# EAGLE design backplane (EAGLE 7.7.0)
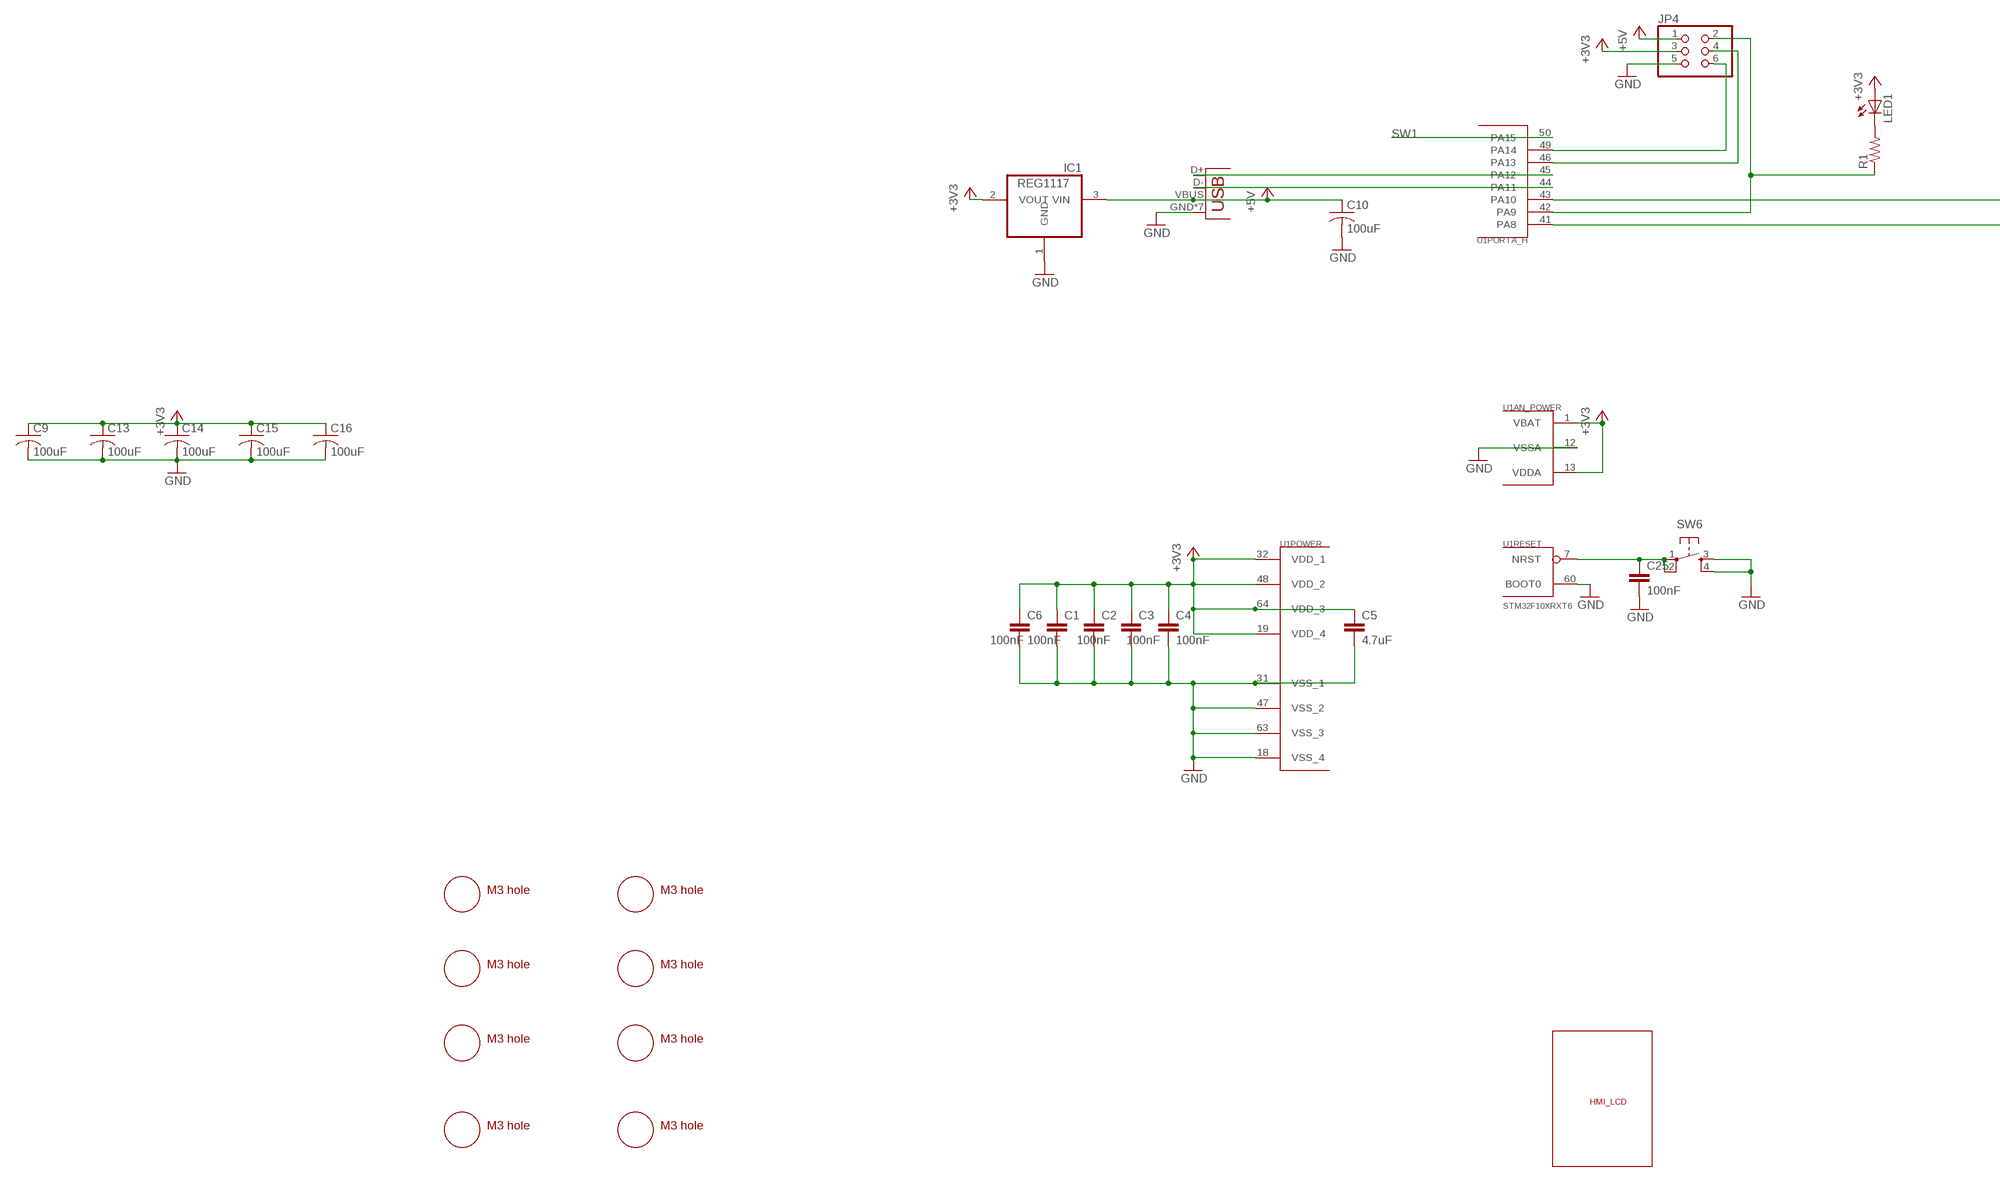
[diagram p0: schematic, sheet 1, part 1 of 2]
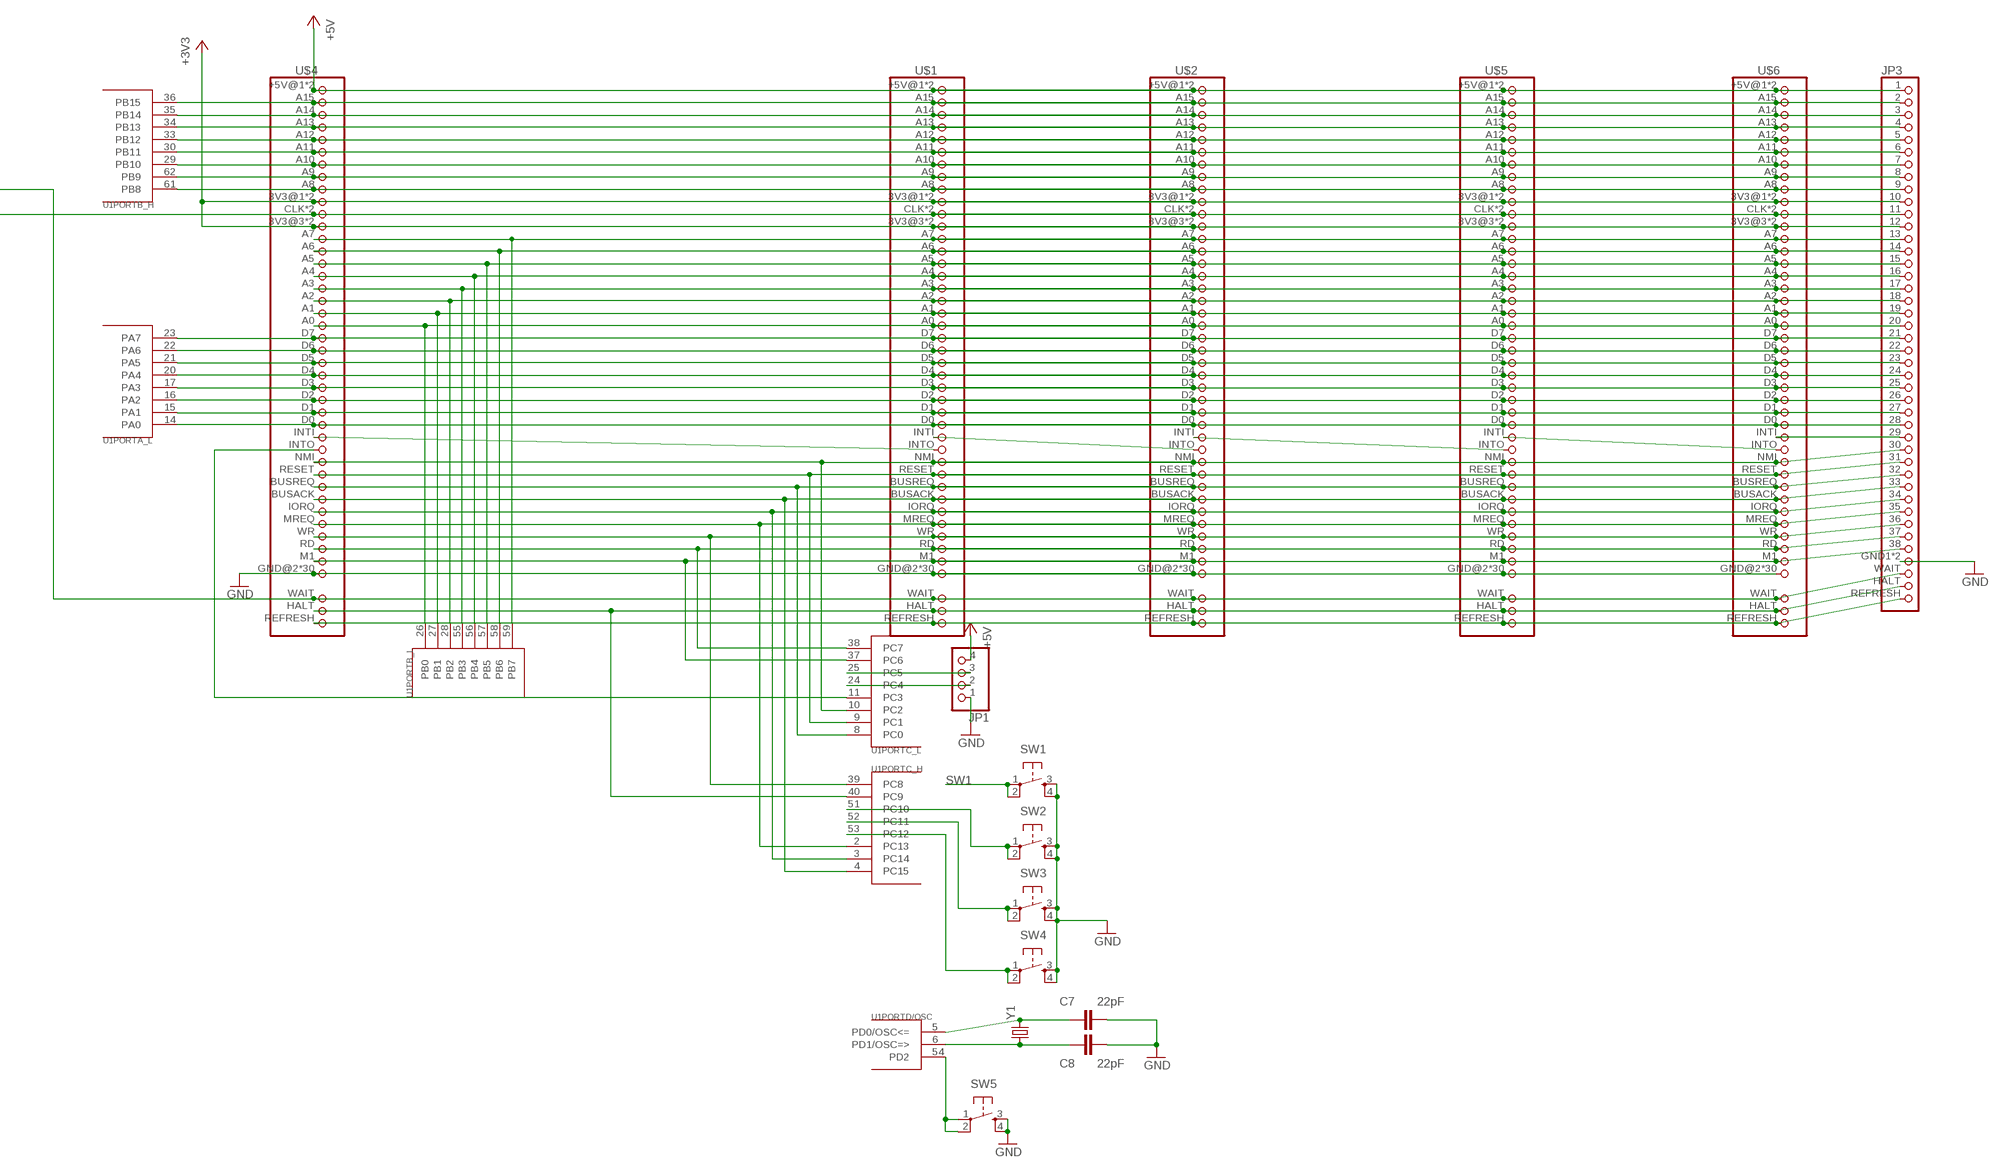
[diagram p1: schematic, sheet 1, part 2 of 2]

## Parts
C1  100nF  CAP0805  [0805]
C2  100nF  CAP0805  [0805]
C3  100nF  CAP0805  [0805]
C4  100nF  CAP0805  [0805]
C5  4.7uF  CAP0805  [0805]
C6  100nF  CAP0805  [0805]
C7  22pF  CAP0805  [0805]
C8  22pF  CAP0805  [0805]
C9  100uF  C-USC1210  [C1210]
C10  100uF  C-USC1210  [C1210]
C13  100uF  C-USC1210  [C1210]
C14  100uF  C-USC1210  [C1210]
C15  100uF  C-USC1210  [C1210]
C16  100uF  C-USC1210  [C1210]
C25  100nF  CAP0805  [0805]
IC1  REG1117  [SOT223]
J1  USB-MICROB  [USB-MICROB]
JP1  PINHD-1X4  [1X04]
JP3  PINHD-1X38  [1X38]
JP4  PINHD-2X3  [2X03]
LED1  LEDCHIP-LED0805  [CHIP-LED0805]
R1  R-US_R0805  [R0805]
SW1  SWITCH_SPST_4_PINSQUARE  [TACTILE-SWITCH-SMD]
SW2  SWITCH_SPST_4_PINSQUARE  [TACTILE-SWITCH-SMD]
SW3  SWITCH_SPST_4_PINSQUARE  [TACTILE-SWITCH-SMD]
SW4  SWITCH_SPST_4_PINSQUARE  [TACTILE-SWITCH-SMD]
SW5  SWITCH_SPST_4_PINSQUARE  [TACTILE-SWITCH-SMD]
SW6  SWITCH_SPST_4_PINSQUARE  [TACTILE-SWITCH-SMD]
U1  STM32F10XRXT6  [TQFP64]
U$1  FAP_BUS  [2X38]
U$2  FAP_BUS  [2X38]
U$3  HMI_LCD  [HMI_LCD]
U$4  FAP_BUS  [2X38]
U$5  FAP_BUS  [2X38]
U$6  FAP_BUS  [2X38]
U$7  M3_MOUNTING_HOLE  [M3_MOUNTING_HOLE_PACK]
U$8  M3_MOUNTING_HOLE  [M3_MOUNTING_HOLE_PACK]
U$9  M3_MOUNTING_HOLE  [M3_MOUNTING_HOLE_PACK]
U$10  M3_MOUNTING_HOLE  [M3_MOUNTING_HOLE_PACK]
U$11  M3_MOUNTING_HOLE  [M3_MOUNTING_HOLE_PACK]
U$12  M3_MOUNTING_HOLE  [M3_MOUNTING_HOLE_PACK]
U$13  M3_MOUNTING_HOLE  [M3_MOUNTING_HOLE_PACK]
U$14  M3_MOUNTING_HOLE  [M3_MOUNTING_HOLE_PACK]
Y1  CRYSTALHC49US  [HC49US]

## Nets
+3V3: C1.1 C2.1 C3.1 C4.1 C5.1 C6.1 C9.1 C13.1 C14.1 C15.1 C16.1 IC1.2(VOUT) JP3.10 JP3.12 JP4.3 LED1.A U1.1(AN_POWER:VBAT) U1.13(AN_POWER:VDDA) U1.19(POWER:VDD_4) U1.32(POWER:VDD_1) U1.48(POWER:VDD_2) U1.64(POWER:VDD_3) U$1.3V3@1 U$1.3V3@2 U$1.3V3@3 U$1.3V3@4 U$2.3V3@1 U$2.3V3@2 U$2.3V3@3 U$2.3V3@4 U$4.3V3@1 U$4.3V3@2 U$4.3V3@3 U$4.3V3@4 U$5.3V3@1 U$5.3V3@2 U$5.3V3@3 U$5.3V3@4 U$6.3V3@1 U$6.3V3@2 U$6.3V3@3 U$6.3V3@4
+5V: C10.1 IC1.3(VIN) J1.VBUS JP1.4 JP3.1 JP4.1 U$1.+5V@1 U$1.+5V@2 U$2.+5V@1 U$2.+5V@2 U$4.+5V@1 U$4.+5V@2 U$5.+5V@1 U$5.+5V@2 U$6.+5V@1 U$6.+5V@2
A0: JP3.20 U1.26(PORTB_L:PB0) U$1.A0 U$2.A0 U$4.A0 U$5.A0 U$6.A0
A7: JP3.13 U1.59(PORTB_L:PB7) U$1.A7 U$2.A7 U$4.A7 U$5.A7 U$6.A7
GND: C1.2 C2.2 C3.2 C4.2 C5.2 C6.2 C7.2 C8.2 C9.2 C10.2 C13.2 C14.2 C15.2 C16.2 C25.2 IC1.1(GND) J1.GND J1.P1(GND) J1.P2(GND) J1.P3(GND) J1.P4(GND) J1.P5(GND) J1.P6(GND) JP1.1 JP3.GND1(GND) JP3.GND2(GND) JP4.5 SW1.3 SW1.4 SW2.3 SW2.4 SW3.3 SW3.4 SW4.3 SW4.4 SW5.3 SW5.4 SW6.3 SW6.4 U1.12(AN_POWER:VSSA) U1.18(POWER:VSS_4) U1.31(POWER:VSS_1) U1.47(POWER:VSS_2) U1.60(RESET:BOOT0) U1.63(POWER:VSS_3) U$1.GND@2(GND) U$1.GND@3(GND) U$1.GND@4(GND) U$1.GND@5(GND) U$1.GND@6(GND) U$1.GND@7(GND) U$1.GND@8(GND) U$1.GND@9(GND) U$1.GND@13(GND) U$1.GND@14(GND) U$1.GND@15(GND) U$1.GND@16(GND) U$1.GND@17(GND) U$1.GND@18(GND) U$1.GND@19(GND) U$1.GND@20(GND) U$1.GND@21(GND) U$1.GND@22(GND) U$1.GND@23(GND) U$1.GND@24(GND) U$1.GND@25(GND) U$1.GND@26(GND) U$1.GND@27(GND) U$1.GND@28(GND) U$1.GND@30(GND) U$1.GND@34(GND) U$1.GND@35(GND) U$1.GND@36(GND) U$1.GND@37(GND) U$1.GND@38(GND) U$2.GND@2(GND) U$2.GND@3(GND) U$2.GND@4(GND) U$2.GND@5(GND) U$2.GND@6(GND) U$2.GND@7(GND) U$2.GND@8(GND) U$2.GND@9(GND) U$2.GND@13(GND) U$2.GND@14(GND) U$2.GND@15(GND) U$2.GND@16(GND) U$2.GND@17(GND) U$2.GND@18(GND) U$2.GND@19(GND) U$2.GND@20(GND) U$2.GND@21(GND) U$2.GND@22(GND) U$2.GND@23(GND) U$2.GND@24(GND) U$2.GND@25(GND) U$2.GND@26(GND) U$2.GND@27(GND) U$2.GND@28(GND) U$2.GND@30(GND) U$2.GND@34(GND) U$2.GND@35(GND) U$2.GND@36(GND) U$2.GND@37(GND) U$2.GND@38(GND) U$4.GND@2(GND) U$4.GND@3(GND) U$4.GND@4(GND) U$4.GND@5(GND) U$4.GND@6(GND) U$4.GND@7(GND) U$4.GND@8(GND) U$4.GND@9(GND) U$4.GND@13(GND) U$4.GND@14(GND) U$4.GND@15(GND) U$4.GND@16(GND) U$4.GND@17(GND) U$4.GND@18(GND) U$4.GND@19(GND) U$4.GND@20(GND) U$4.GND@21(GND) U$4.GND@22(GND) U$4.GND@23(GND) U$4.GND@24(GND) U$4.GND@25(GND) U$4.GND@26(GND) U$4.GND@27(GND) U$4.GND@28(GND) U$4.GND@30(GND) U$4.GND@34(GND) U$4.GND@35(GND) U$4.GND@36(GND) U$4.GND@37(GND) U$4.GND@38(GND) U$5.GND@2(GND) U$5.GND@3(GND) U$5.GND@4(GND) U$5.GND@5(GND) U$5.GND@6(GND) U$5.GND@7(GND) U$5.GND@8(GND) U$5.GND@9(GND) U$5.GND@13(GND) U$5.GND@14(GND) U$5.GND@15(GND) U$5.GND@16(GND) U$5.GND@17(GND) U$5.GND@18(GND) U$5.GND@19(GND) U$5.GND@20(GND) U$5.GND@21(GND) U$5.GND@22(GND) U$5.GND@23(GND) U$5.GND@24(GND) U$5.GND@25(GND) U$5.GND@26(GND) U$5.GND@27(GND) U$5.GND@28(GND) U$5.GND@30(GND) U$5.GND@34(GND) U$5.GND@35(GND) U$5.GND@36(GND) U$5.GND@37(GND) U$5.GND@38(GND) U$6.GND@2(GND) U$6.GND@3(GND) U$6.GND@4(GND) U$6.GND@5(GND) U$6.GND@6(GND) U$6.GND@7(GND) U$6.GND@8(GND) U$6.GND@9(GND) U$6.GND@13(GND) U$6.GND@14(GND) U$6.GND@15(GND) U$6.GND@16(GND) U$6.GND@17(GND) U$6.GND@18(GND) U$6.GND@19(GND) U$6.GND@20(GND) U$6.GND@21(GND) U$6.GND@22(GND) U$6.GND@23(GND) U$6.GND@24(GND) U$6.GND@25(GND) U$6.GND@26(GND) U$6.GND@27(GND) U$6.GND@28(GND) U$6.GND@30(GND) U$6.GND@34(GND) U$6.GND@35(GND) U$6.GND@36(GND) U$6.GND@37(GND) U$6.GND@38(GND)
N$1: JP3.29 U$6.INTI
N$2: U$5.INTI U$6.INTO
N$3: JP3.3 U1.35(PORTB_H:PB14) U$1.A14 U$2.A14 U$4.A14 U$5.A14 U$6.A14
N$4: JP3.4 U1.34(PORTB_H:PB13) U$1.A13 U$2.A13 U$4.A13 U$5.A13 U$6.A13
N$5: U$1.INTO U$4.INTI
N$6: U$1.INTI U$2.INTO
N$7: JP3.7 U1.29(PORTB_H:PB10) U$1.A10 U$2.A10 U$4.A10 U$5.A10 U$6.A10
N$8: U1.11(PORTC_L:PC3) U$4.INTO
N$9: JP3.9 U1.61(PORTB_H:PB8) U$1.A8 U$2.A8 U$4.A8 U$5.A8 U$6.A8
N$10: U$2.INTI U$5.INTO
N$11: JP3.22 U1.22(PORTA_L:PA6) U$1.D6 U$2.D6 U$4.D6 U$5.D6 U$6.D6
N$12: LED1.C R1.2
N$13: JP3.24 U1.20(PORTA_L:PA4) U$1.D4 U$2.D4 U$4.D4 U$5.D4 U$6.D4
N$14: JP3.27 U1.15(PORTA_L:PA1) U$1.D1 U$2.D1 U$4.D1 U$5.D1 U$6.D1
N$16: JP3.26 U1.16(PORTA_L:PA2) U$1.D2 U$2.D2 U$4.D2 U$5.D2 U$6.D2
N$18: JP3.28 U1.14(PORTA_L:PA0) U$1.D0 U$2.D0 U$4.D0 U$5.D0 U$6.D0
N$19: JP3.REFRESH U$1.REFRESH U$2.REFRESH U$4.REFRESH U$5.REFRESH U$6.REFRESH
N$20: JP3.30 U1.10(PORTC_L:PC2) U$1.NMI U$2.NMI U$4.NMI U$5.NMI U$6.NMI
N$21: JP3.HALT U1.40(PORTC_H:PC9) U$1.HALT U$2.HALT U$4.HALT U$5.HALT U$6.HALT
N$22: JP3.25 U1.17(PORTA_L:PA3) U$1.D3 U$2.D3 U$4.D3 U$5.D3 U$6.D3
N$23: JP3.31 U1.9(PORTC_L:PC1) U$1.RESET U$2.RESET U$4.RESET U$5.RESET U$6.RESET
N$24: JP3.32 U1.8(PORTC_L:PC0) U$1.BUSREQ U$2.BUSREQ U$4.BUSREQ U$5.BUSREQ U$6.BUSREQ
N$25: JP3.35 U1.2(PORTC_H:PC13) U$1.MREQ U$2.MREQ U$4.MREQ U$5.MREQ U$6.MREQ
N$26: JP3.36 U1.39(PORTC_H:PC8) U$1.WR U$2.WR U$4.WR U$5.WR U$6.WR
N$27: JP3.WAIT U1.43(PORTA_H:PA10) U$1.WAIT U$2.WAIT U$4.WAIT U$5.WAIT U$6.WAIT
N$28: JP3.38 U1.37(PORTC_L:PC6) U$1.M1 U$2.M1 U$4.M1 U$5.M1 U$6.M1
N$30: JP3.23 U1.21(PORTA_L:PA5) U$1.D5 U$2.D5 U$4.D5 U$5.D5 U$6.D5
N$31: JP3.15 U1.57(PORTB_L:PB5) U$1.A5 U$2.A5 U$4.A5 U$5.A5 U$6.A5
N$34: JP3.8 U1.62(PORTB_H:PB9) U$1.A9 U$2.A9 U$4.A9 U$5.A9 U$6.A9
N$38: JP3.21 U1.23(PORTA_L:PA7) U$1.D7 U$2.D7 U$4.D7 U$5.D7 U$6.D7
N$39: JP3.6 U1.30(PORTB_H:PB11) U$1.A11 U$2.A11 U$4.A11 U$5.A11 U$6.A11
N$40: JP3.5 U1.33(PORTB_H:PB12) U$1.A12 U$2.A12 U$4.A12 U$5.A12 U$6.A12
N$43: JP3.2 U1.36(PORTB_H:PB15) U$1.A15 U$2.A15 U$4.A15 U$5.A15 U$6.A15
N$45: JP3.19 U1.27(PORTB_L:PB1) U$1.A1 U$2.A1 U$4.A1 U$5.A1 U$6.A1
N$47: JP3.17 U1.55(PORTB_L:PB3) U$1.A3 U$2.A3 U$4.A3 U$5.A3 U$6.A3
N$48: JP3.16 U1.56(PORTB_L:PB4) U$1.A4 U$2.A4 U$4.A4 U$5.A4 U$6.A4
N$52: JP3.11 U1.41(PORTA_H:PA8) U$1.CLK U$1.CLK@2 U$2.CLK U$2.CLK@2 U$4.CLK U$4.CLK@2 U$5.CLK U$5.CLK@2 U$6.CLK U$6.CLK@2
N$54: JP1.2 U1.24(PORTC_L:PC4)
N$55: JP1.3 U1.25(PORTC_L:PC5)
N$56: JP3.33 U1.4(PORTC_H:PC15) U$1.BUSACK U$2.BUSACK U$4.BUSACK U$5.BUSACK U$6.BUSACK
N$57: JP3.34 U1.3(PORTC_H:PC14) U$1.IORQ U$2.IORQ U$4.IORQ U$5.IORQ U$6.IORQ
N$58: C25.1 SW6.1 SW6.2 U1.7(RESET:NRST)
N$59: SW5.1 SW5.2 U1.54(PORTD/OSC:PD2)
N$62: JP4.6 U1.49(PORTA_H:PA14)
N$63: SW2.1 SW2.2 U1.51(PORTC_H:PC10)
N$64: SW3.1 SW3.2 U1.52(PORTC_H:PC11)
N$65: SW4.1 SW4.2 U1.53(PORTC_H:PC12)
N$66: JP4.4 U1.46(PORTA_H:PA13)
N$67: JP4.2 R1.1 U1.42(PORTA_H:PA9)
N$68: JP3.37 U1.38(PORTC_L:PC7) U$1.RD U$2.RD U$4.RD U$5.RD U$6.RD
N$93: J1.D+ U1.45(PORTA_H:PA12)
N$94: C8.1 U1.6(PORTD/OSC:PD1/OSC=>) Y1.1
N$95: C7.1 U1.5(PORTD/OSC:PD0/OSC<=) Y1.2
N$96: J1.D- U1.44(PORTA_H:PA11)
N$128: JP3.14 U1.58(PORTB_L:PB6) U$1.A6 U$2.A6 U$4.A6 U$5.A6 U$6.A6
N$132: JP3.18 U1.28(PORTB_L:PB2) U$1.A2 U$2.A2 U$4.A2 U$5.A2 U$6.A2
SW1: SW1.1 SW1.2 U1.50(PORTA_H:PA15)

## Library data of the parts
C1-C8 C25 = SparkFun-Capacitors:CAP: Capacitor Standard 0603 ceramic capacitor, and 0.1" leaded capacitor.
C9 C10 C13-C16 = adafruit:C-US: CAPACITOR, American symbol
IC1 = burr-brown:REG1117: 800mA and 1A Low Dropout (LDO) Positive Regulator 1.8V, 2.5V, 2.85V, 3.3V, 5V, and Adj; MPN: REG1117; OC_FARNELL: 1097566; OC_NEWARK: 14P6981
J1 = v3:USB: USB Connectors USB-B-PTH is fully proven SKU : PRT-00139/CONN-08278 USB-miniB is fully proven SKU : PRT-00587 USB-A-PCB is untested. USB-A-H is throughly reviewed, but untested. Spark Fun Electronics SKU : PRT-00437 USB-B-SMT is throughly reviewed, but untested. Needs silkscreen touching up. USB-A-S has not been used/tested USB-MB-H has not been used/tested USB-MICROB has been used. CONN-09505; PROD_ID: CONN-09505
JP1 = pinhead:PINHD-1X4: PIN HEADER
JP3 = fap_bus_backplane:PINHD-1X38: PIN HEADER
JP4 = pinhead:PINHD-2X3: PIN HEADER
LED1 = adafruit:LED: LED OSRAM: - CHIPLED LG R971, LG N971, LY N971, LG Q971, LY Q971, LO R971, LY R971 LH N974, LH R974 LS Q976, LO Q976, LY Q976 LO Q996 - Hyper CHIPLED LW Q18S LB Q993, LB Q99A, LB R99A - SideLED LS A670, LO A670, LY A670, LG A670, LP A670 LB A673, LV A673, LT A673, LW A673 LH A674 LY A675 LS A676, LA A676, LO A676, LY A676, LW A676 LS A679, LY A679, LG A679 - Hyper Micro SIDELED® LS Y876, LA Y876, LO Y876, LY Y876 LT Y87S - SmartLED LW L88C, LW L88S LB L89C, LB L89S, LG L890 LS L89K, LO L89K, LY L89K LS L896, LA L896, LO L896, LY L896 - TOPLED LS T670, LO T670, LY T670, LG T670, LP T670 LSG T670, LSP T670, LSY T670, LOP T670, LYG T670 LG T671, LOG T671, LSG T671 LB T673, LV T673, LT T673, LW T673 LH T674 LS T676, LA T676, LO T676, LY T676, LB T676, LH T676, LSB T676, LW T676 LB T67C, LV T67C, LT T67C, LS T67K, LO T67K, LY T67K, LW E67C LS E67B, LA E67B, LO E67B, LY E67B, LB E67C, LV E67C, LT E67C LW T67C LS T679, LY T679, LG T679 LS T770, LO T770, LY T770, LG T770, LP T770 LB T773, LV T773, LT T773, LW T773 LH T774 LS E675, LA E675, LY E675, LS T675 LS T776, LA T776, LO T776, LY T776, LB T776 LHGB T686 LT T68C, LB T68C - Hyper Mini TOPLED® LB M676 - Mini TOPLED Santana® LG M470 LS M47K, LO M47K, LY M47K Source: http://www.osram.convergy.de/
R1 = adafruit:R-US_: RESISTOR, American symbol
SW1-SW6 = SparkFun-Electromechanical:SWITCH_SPST_4_PIN; PROD_ID: SWCH-08247
U1 = stm32:STM32F10XRXT6: STM32F101/103 64pin LQFP
U$1 U$2 U$4-U$6 = fap_bus_backplane:FAP_BUS
U$3 = hmi_lcd:HMI_LCD
U$7-U$14 = m3_mounting_hole:M3_MOUNTING_HOLE
Y1 = SparkFun-FreqCtrl:CRYSTAL: Various standard crystals. Proven footprints.

## Board
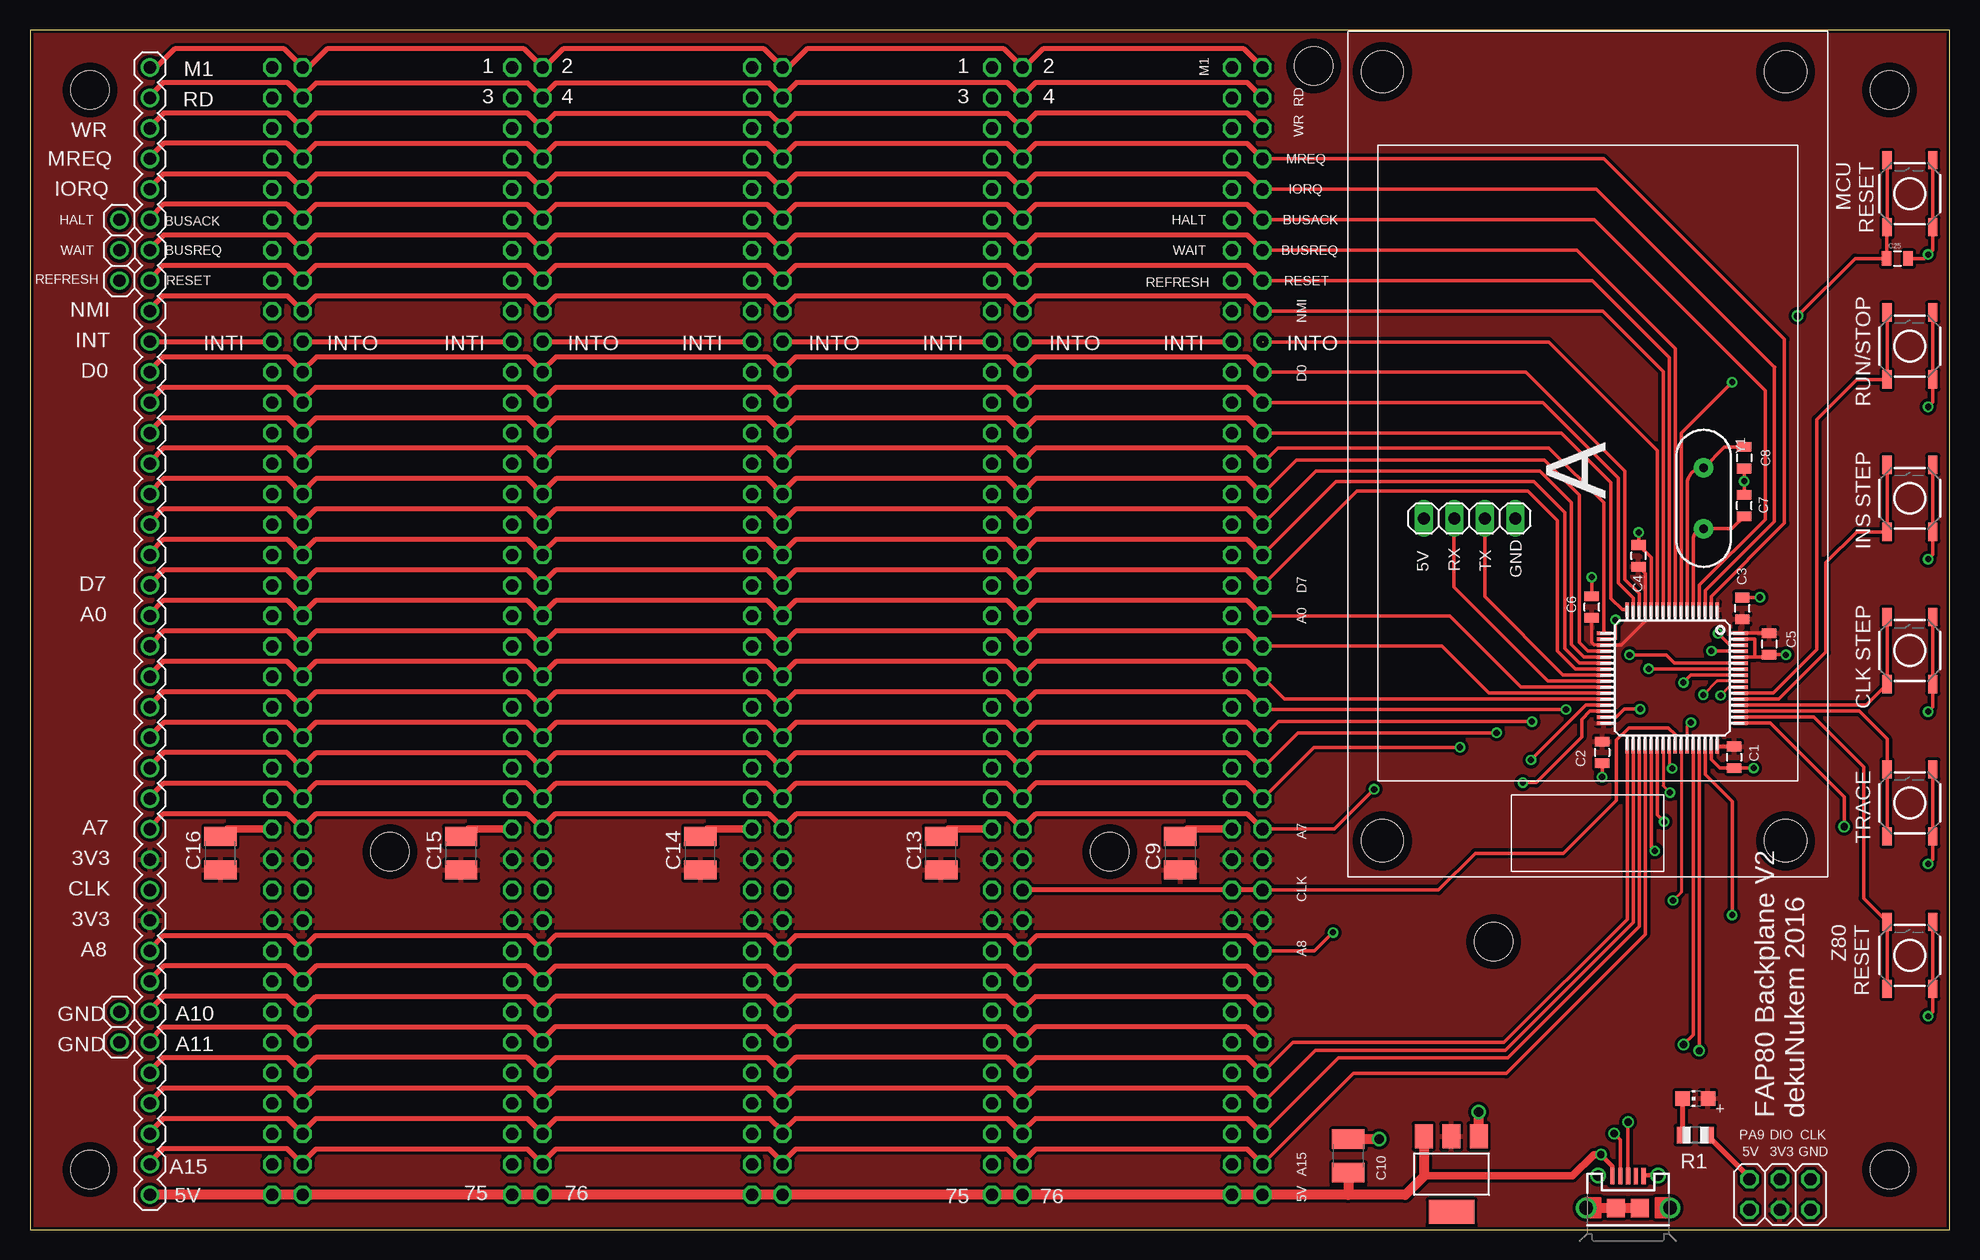
[diagram p2: board, top side]
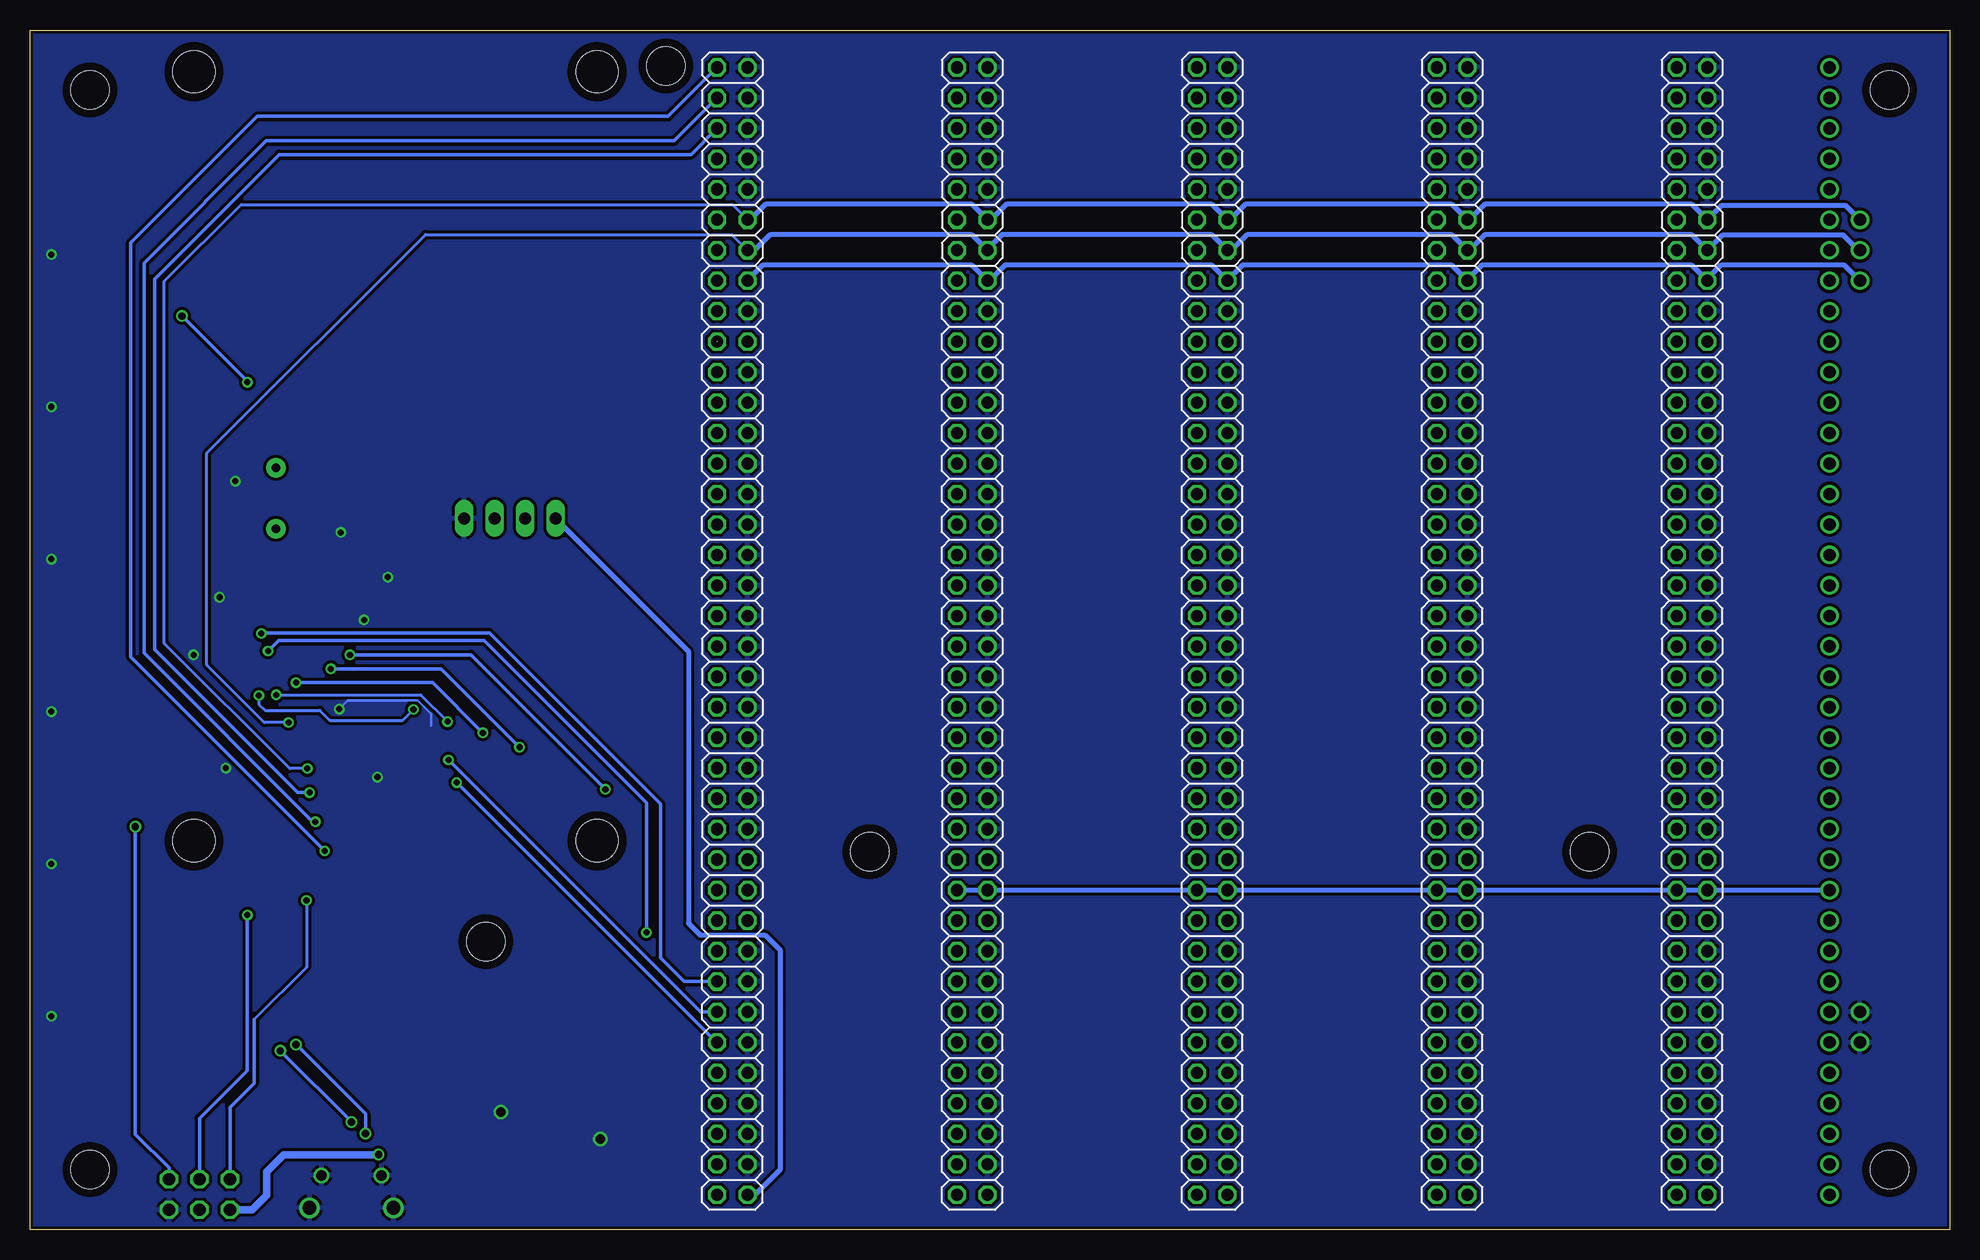
[diagram p3: board, bottom side, seen from below]

Size 160 x 100 mm. Coordinates in mm from the lower left corner, seen from the top.
Outline: 0,0 160,0 160,100 0,100 0,0
Copper layers (1*16): Top 0.035mm / dielectric 1.5mm / Bottom 0.035mm
Design rules "SparkFun-2-layer-TIGHT": minimum track width 7mil, minimum drill 15mil, track to track 7mil, track to pad 7mil, pad to pad 7mil, via to via 7mil, smd to smd 7mil, copper to edge 7mil, drill to drill 7mil, minimum pad ring 7mil, minimum via ring 7mil, stop-mask expansion 4mil, vias tented up to drill 25mil, thermal gap 10mil

### Footprints (pad centres in the part's own frame; a part is rotated, then mirrored left to right if it is on the bottom)
0805 = smd 0.8 x 1.2: 1 -0.9,0; 2 0.9,0
C1210 = smd 1.6 x 2.7: 1 -1.4,0; 2 1.4,0
SOT223 = smd 1.499 x 2.007: 1 -2.261,-3.15; 2 0.025,-3.15; 3 2.311,-3.15 | smd 3.81 x 2.007: 4 0,3.15
USB-MICROB = smd 0.35 x 1.4: D+ 0,2.65; D- -0.65,2.65; GND 1.3,2.65; ID 0.65,2.65; VBUS -1.3,2.65 | smd 1.5 x 1.55: P1 -1,0; P2 1,0 | drill 1.15 pad 1.422: P3 -3.5,0; P4 3.5,0 | drill 0.85 pad 1.27: P5 -2.5,2.7; P6 2.5,2.7
1X04 = drill 1.016 long: 1 -3.81,0; 2 -1.27,0; 3 1.27,0; 4 3.81,0
1X38 = drill 1.016: 1 -49.53,0; 2 -46.99,0; 3 -44.45,0; 4 -41.91,0; 5 -39.37,0; 6 -36.83,0; 7 -34.29,0; 8 -31.75,0; 9 -29.21,0; 10 -26.67,0; 11 -24.13,0; 12 -21.59,0; 13 -19.05,0; 14 -16.51,0; 15 -13.97,0; 16 -11.43,0; 17 -8.89,0; 18 -6.35,0; 19 -3.81,0; 20 -1.27,0; 21 1.27,0; 22 3.81,0; 23 6.35,0; 24 8.89,0; 25 11.43,0; 26 13.97,0; 27 16.51,0; 28 19.05,0; 29 21.59,0; 30 24.13,0; 31 26.67,0; 32 29.21,0; 33 31.75,0; 34 34.29,0; 35 36.83,0; 36 39.37,0; 37 41.91,0; 38 44.45,0; GND1 -36.83,2.54; GND2 -34.29,2.54; HALT 31.75,2.54; REFRESH 26.67,2.54; WAIT 29.21,2.54
2X03 = drill 1.016 octagon: 1 -2.54,-1.27; 2 -2.54,1.27; 3 0,-1.27; 4 0,1.27; 5 2.54,-1.27; 6 2.54,1.27
CHIP-LED0805 = smd 1.2 x 1.2: A 0,-1.05; C 0,1.05
R0805 = smd 1.1 x 1.4: 1 -1,0; 2 1,0
TACTILE-SWITCH-SMD = smd 1.524 x 0.762: 1 -2.794,1.905; 2 2.794,1.905; 3 -2.794,-1.905; 4 2.794,-1.905
TQFP64 = smd 1.2 x 0.3: 1 -5.7,3.75; 2 -5.7,3.25; 3 -5.7,2.75; 4 -5.7,2.25; 5 -5.7,1.75; 6 -5.7,1.25; 7 -5.7,0.75; 8 -5.7,0.25; 9 -5.7,-0.25; 10 -5.7,-0.75; 11 -5.7,-1.25; 12 -5.7,-1.75; 13 -5.7,-2.25; 14 -5.7,-2.75; 15 -5.7,-3.25; 16 -5.7,-3.75; 33 5.7,-3.75; 34 5.7,-3.25; 35 5.7,-2.75; 36 5.7,-2.25; 37 5.7,-1.75; 38 5.7,-1.25; 39 5.7,-0.75; 40 5.7,-0.25; 41 5.7,0.25; 42 5.7,0.75; 43 5.7,1.25; 44 5.7,1.75; 45 5.7,2.25; 46 5.7,2.75; 47 5.7,3.25; 48 5.7,3.75 | smd 0.3 x 1.2: 17 -3.75,-5.7; 18 -3.25,-5.7; 19 -2.75,-5.7; 20 -2.25,-5.7; 21 -1.75,-5.7; 22 -1.25,-5.7; 23 -0.75,-5.7; 24 -0.25,-5.7; 25 0.25,-5.7; 26 0.75,-5.7; 27 1.25,-5.7; 28 1.75,-5.7; 29 2.25,-5.7; 30 2.75,-5.7; 31 3.25,-5.7; 32 3.75,-5.7; 49 3.75,5.7; 50 3.25,5.7; 51 2.75,5.7; 52 2.25,5.7; 53 1.75,5.7; 54 1.25,5.7; 55 0.75,5.7; 56 0.25,5.7; 57 -0.25,5.7; 58 -0.75,5.7; 59 -1.25,5.7; 60 -1.75,5.7; 61 -2.25,5.7; 62 -2.75,5.7; 63 -3.25,5.7; 64 -3.75,5.7
2X38 = drill 1.016 octagon: 3V3@1 -16.51,1.27; 3V3@2 -16.51,3.81; 3V3@3 -11.43,1.27; 3V3@4 -11.43,3.81; +5V@1 -39.37,1.27; +5V@2 -39.37,3.81; A0 8.89,1.27; A1 6.35,1.27; A2 3.81,1.27; A3 1.27,1.27; A4 -1.27,1.27; A5 -3.81,1.27; A6 -6.35,1.27; A7 -8.89,1.27; A8 -19.05,1.27; A9 -21.59,1.27; A10 -24.13,1.27; A11 -26.67,1.27; A12 -29.21,1.27; A13 -31.75,1.27; A14 -34.29,1.27; A15 -36.83,1.27; BUSACK 41.91,1.27; BUSREQ 39.37,1.27; CLK -13.97,1.27; CLK@2 -13.97,3.81; D0 29.21,1.27; D1 26.67,1.27; D2 24.13,1.27; D3 21.59,1.27; D4 19.05,1.27; D5 16.51,1.27; D6 13.97,1.27; D7 11.43,1.27; GND@2 -36.83,3.81; GND@3 -34.29,3.81; GND@4 -31.75,3.81; GND@5 -29.21,3.81; GND@6 -26.67,3.81; GND@7 -24.13,3.81; GND@8 -21.59,3.81; GND@9 -19.05,3.81; GND@13 -8.89,3.81; GND@14 -6.35,3.81; GND@15 -3.81,3.81; GND@16 -1.27,3.81; GND@17 1.27,3.81; GND@18 3.81,3.81; GND@19 6.35,3.81; GND@20 8.89,3.81; GND@21 11.43,3.81; GND@22 13.97,3.81; GND@23 16.51,3.81; GND@24 19.05,3.81; GND@25 21.59,3.81; GND@26 24.13,3.81; GND@27 26.67,3.81; GND@28 29.21,3.81; GND@30 34.29,3.81; GND@34 44.45,3.81; GND@35 46.99,3.81; GND@36 49.53,3.81; GND@37 52.07,3.81; GND@38 54.61,3.81; HALT 41.91,3.81; INTI 31.75,3.81; INTO 31.75,1.27; IORQ 44.45,1.27; M1 54.61,1.27; MREQ 46.99,1.27; NMI 34.29,1.27; RD 52.07,1.27; REFRESH 36.83,3.81; RESET 36.83,1.27; WAIT 39.37,3.81; WR 49.53,1.27
HMI_LCD = hole 3.5: 0,0; 64.1,0; 0,33.6; 64.1,33.6
M3_MOUNTING_HOLE_PACK = hole 3.2: 0,0
HC49US = drill 0.7 pad 1.651: 1 -2.54,0; 2 2.54,0

### Placement (x,y rotation side)
C1  142.04,39.37 270 top
C2  131.04,39.78 270 top
C3  142.73,51.79 90 top
C4  134.08,56.16 90 top
C5  144.96,48.82 270 top
C6  130.18,51.89 90 top
C7  142.88,60.35 90 top
C8  142.88,64.34 270 top
C9  95.89,31.37 90 top
C10  109.89,6.15 90 top
C13  75.95,31.37 90 top
C14  55.88,31.37 90 top
C15  35.94,31.37 90 top
C16  15.88,31.37 90 top
C25  155.66,80.95 0 top
IC1  118.5,4.62 180 top
J1  133.2,1.8 0 top
JP1  120,59.28 180 top
JP3  10,52.43 90 top
JP4  145.87,2.92 0 top
LED1  138.81,10.92 90 top
R1  138.81,7.87 180 top
SW1  156.7,22.86 90 top
SW2  156.7,35.56 90 top
SW3  156.7,48.26 90 top
SW4  156.7,60.96 90 top
SW5  156.7,73.66 90 top
SW6  156.7,86.36 90 top
U1  136.89,45.97 270 top
U$1  84,42.27 90 top
U$2  64,42.27 90 top
U$3  146.33,32.41 90 top
U$4  104,42.27 90 top
U$5  44,42.27 90 top
U$6  24,42.27 90 top
U$7  5,95 0 top
U$8  155,95 0 top
U$9  5,5 0 top
U$10  155,5 0 top
U$11  30,31.5 0 top
U$12  90,31.5 0 top
U$13  107,97 0 top
U$14  122,24 0 top
Y1  139.5,60.96 270 top

### Tracks (layer width: path | path; a pad name or v marks a point on that pad's centre or on a via)
+3V3
  Top 0.254: U1.19 130.37,48.72 130.18,48.92 C6.1
  Top 0.305: C4.1 134.64,54.7 U1.13 134.64,50.71 132.64,48.72 U1.19 | U1.48 C1.1 | U1.64 C5.1
  pour Top (isolate 0.254): -0.09,0.13 160,0 160,100 -0.09,100.13
+5V  (via drill 0.6)
  Top 0.356: J1.VBUS 131.9,5.29 v130.94,6.25
  Top 0.61: v130.94,6.25 130.35,6.25 128.57,4.47 116.46,4.47 116.21,4.72
  Top 0.813: 116.21,4.48 114.63,2.9 109.89,2.9 | 109.89,2.9 U$4.+5V@1 U$4.+5V@2 U$1.+5V@1 U$1.+5V@2 U$2.+5V@1 U$2.+5V@2 U$5.+5V@1 | 43.1,2.9 U$5.+5V@1 | U$5.+5V@1 U$5.+5V@2 U$6.+5V@1 U$6.+5V@2 JP3.1 | C10.1 109.89,2.9 | 116.22,4.47 116.21,4.48 | 116.21,4.48 116.21,4.72 116.21,7.75 IC1.3
  Bottom 0.406: JP1.4 105.11,48.2 105.11,25.53 104.14,24.56 98.73,24.56 97.48,23.32 97.48,4.98 99.57,2.9 U$4.+5V@2
  Bottom 0.61: v130.94,6.25 138.84,6.25 140.26,4.83 140.26,2.87 141.48,1.65 JP4.1
A0
  Top 0.305: U1.26 124.27,45.22 118.36,51.13 102.75,51.13 U$4.A0
  Top 0.406: U$4.A0 101.46,52.43 83.8,52.43 82.73,51.36 U$1.A0 81.46,52.43 63.8,52.43 62.73,51.35 U$2.A0 61.46,52.43 43.81,52.43 42.73,51.34 U$5.A0 41.46,52.43 23.8,52.43 22.73,51.36 U$6.A0 21.46,52.43 11.07,52.43 10,51.35 JP3.20
A7  (via drill 0.51)
  Top 0.305: v133.33,47.9 136.38,47.9 137.06,47.22 U1.59 | v112.04,36.7 108.71,33.38 U$4.A7
  Top 0.406: U$4.A7 101.46,34.65 83.82,34.65 82.73,33.56 U$1.A7 81.46,34.65 63.86,34.65 62.73,33.52 | 62.73,33.52 U$2.A7 | 62.73,33.52 61.6,34.65 43.76,34.65 42.73,33.61 U$5.A7 41.46,34.65 23.8,34.65 22.73,33.58 U$6.A7 21.46,34.65 11.07,34.65 10,33.57 JP3.13
  Bottom 0.305: v133.33,47.9 123.24,47.9 v112.04,36.7
GND  (via drill 0.51, 0.8)
  Top 0.305: v130.18,54.38 C6.2 | v132.16,50.83 132.16,49.22 U1.18 | v134.22,43.38 132.9,43.38 132.24,42.72 U1.31 | C8.2 v142.88,62.38 C7.2 | v131.04,37.72 C2.2 | SW1.4 SW1.3 158.6,18.16 v158.22,17.78 | SW2.4 SW2.3 158.6,30.86 v158.22,30.48 | SW3.4 SW3.3 158.6,43.56 v158.22,43.18 | SW4.4 SW4.3 158.6,56.26 v158.22,55.88 | SW5.4 SW5.3 158.6,68.96 v158.22,68.58 | SW6.4 SW6.3 158.6,81.66 v158.22,81.28 157.89,80.95 C25.2 | 143.77,47.72 144.77,47.72 C5.2 146.35,47.92 v146.36,47.9 | 143.77,47.72 U1.60 | U1.63 143.77,49.22 143.77,47.72 | U1.47 140.14,39.17 140.83,38.47 C1.2 v143.67,38.47 | U1.12 135.14,56.01 C4.2 134.09,57.07 v134.09,58.12 | v144.2,52.7 144.19,52.69 C3.2
  Top 0.356: J1.P6 134.55,4.5 J1.GND
  Top 0.61: C16.2 16.48,33.38 U$6.GND@13 | C15.2 36.55,33.38 U$5.GND@13 | C14.2 56.49,33.38 U$2.GND@13 | C13.2 76.55,33.38 U$1.GND@13 | C9.2 96.49,33.38 U$4.GND@13
  Top 0.813: 120.83,7.7 IC1.1 | IC1.1 v120.76,9.78 | C10.2 v112.45,7.54 | 120.84,7.69 IC1.1 | J1.P3 J1.P1 J1.P2
  Bottom 0.203: v134.22,43.38 133.51,44.09 127.69,44.09 126.57,42.98 126.57,42.01
  pour Bottom (isolate 0.254): 0,0 160,0 160,100.33 0,100
N$1
  Top 0.406: JP3.29 U$6.INTI
N$2
  Top 0.406: U$6.INTO U$5.INTI
N$3
  Top 0.305: U1.35 134.14,25.27 123.17,14.3 109.06,14.3 U$4.A14
  Top 0.406: 62.73,8.17 63.8,9.25 81.46,9.25 U$1.A14 82.73,8.18 83.8,9.25 101.46,9.25 U$4.A14 | 62.73,8.17 U$2.A14 | 62.73,8.17 61.66,9.25 43.81,9.25 42.73,8.16 U$5.A14 41.46,9.25 23.82,9.25 22.73,8.15 U$6.A14 21.46,9.25 11.1,9.25 10,8.15 JP3.3
N$4
  Top 0.305: U1.34 133.64,25.6 122.98,14.95 107.16,14.95 U$4.A13
  Top 0.406: U$4.A13 101.46,11.79 83.84,11.79 82.73,10.67 U$1.A13 81.46,11.79 63.8,11.79 62.73,10.71 U$2.A13 61.46,11.79 43.84,11.79 42.73,10.68 U$5.A13 41.46,11.79 23.8,11.79 22.73,10.72 U$6.A13 21.46,11.79 11.1,11.79 10,10.69 JP3.4
N$5
  Top 0.406: U$1.INTO U$4.INTI
N$6
  Top 0.406: U$2.INTO U$1.INTI
N$7  (via drill 0.51)
  Top 0.305: U1.29 129.7,43.72 v125.12,39.14
  Top 0.406: U$4.A10 101.46,19.41 83.8,19.41 82.73,18.34 U$1.A10 81.41,19.46 63.8,19.46 62.73,18.38 U$2.A10 61.44,19.43 43.79,19.43 42.73,18.37 U$5.A10 41.48,19.38 23.77,19.38 22.73,18.34 U$6.A10 21.41,19.46 11.1,19.46 10,18.36 JP3.7
  Bottom 0.305: v125.12,39.14 104.11,18.14 U$4.A10
N$8  (1 unrouted)
  Top 0.305: U1.11 135.64,64.95 126.59,73.99 102.75,73.99
N$9  (via drill 0.51)
  Top 0.305: 102.75,23.24 U$4.A8 107.06,23.22 v108.61,24.77 | v140.16,48.23 140.17,48.22 U1.61
  Top 0.406: U$4.A8 101.48,24.46 83.87,24.46 82.73,23.32 U$1.A8 81.46,24.49 63.8,24.49 62.73,23.41 U$2.A8 61.44,24.51 43.79,24.51 42.73,23.45 U$5.A8 41.46,24.49 23.77,24.49 22.73,23.44 U$6.A8 21.48,24.46 11.05,24.46 10,23.41 JP3.9
  Bottom 0.305: v140.16,48.23 139.27,49.12 122.15,49.12 108.61,35.58 v108.61,24.77
N$10
  Top 0.406: U$5.INTO U$2.INTI
N$11
  Top 0.305: U1.22 129.13,47.22 127.92,48.44 127.92,59.79 125.35,62.36 108.85,62.36 U$4.D6
  Top 0.406: U$4.D6 101.46,57.51 83.82,57.51 82.73,56.42 U$1.D6 81.46,57.51 63.8,57.51 62.73,56.43 U$2.D6 61.44,57.53 43.84,57.53 42.73,56.42 U$5.D6 41.46,57.51 23.77,57.51 22.73,56.46 U$6.D6 21.46,57.51 11.07,57.51 10,56.43 JP3.22
N$12
  Top 0.406: R1.2 137.76,7.92 LED1.C
N$13
  Top 0.305: U1.20 129.86,48.22 129.16,48.92 129.16,61.21 126.24,64.14 105.55,64.14 U$4.D4
  Top 0.406: U$4.D4 101.46,62.59 83.82,62.59 82.73,61.5 U$1.D4 81.46,62.59 63.8,62.59 62.73,61.51 U$2.D4 61.46,62.59 43.84,62.59 42.73,61.48 U$5.D4 41.46,62.59 23.82,62.59 22.73,61.49 U$6.D4 21.46,62.59 11.1,62.59 10,61.49 JP3.24
N$14
  Top 0.305: U1.15 133.64,52.65 132.39,53.9 132.39,62.64 126.09,68.94 U$4.D1
  Top 0.406: U$4.D1 101.46,70.21 83.8,70.21 82.73,69.14 U$1.D1 81.48,70.18 63.8,70.18 62.73,69.11 | 62.73,69.11 U$2.D1 | 62.73,69.11 61.63,70.21 43.81,70.21 42.73,69.12 U$5.D1 41.46,70.21 23.8,70.21 22.73,69.14 U$6.D1 21.46,70.21 11.1,70.21 10,69.11 JP3.27
N$16
  Top 0.305: U1.16 132.71,51.67 131.78,52.6 131.78,62.26 127.64,66.4 U$4.D2
  Top 0.406: U$4.D2 101.46,67.67 83.82,67.67 82.73,66.58 U$1.D2 81.46,67.67 63.8,67.67 62.73,66.59 U$2.D2 61.46,67.67 43.81,67.67 42.73,66.58 U$5.D2 41.46,67.67 23.82,67.67 22.73,66.57 U$6.D2 21.46,67.67 11.1,67.67 10,66.57 JP3.26
N$18
  Top 0.305: U1.14 134.14,53.02 132.95,54.2 132.95,63.22 124.69,71.48 U$4.D0
  Top 0.406: U$4.D0 101.46,72.75 83.82,72.75 82.73,71.66 U$1.D0 81.46,72.75 63.83,72.75 62.73,71.64 U$2.D0 61.46,72.75 43.84,72.75 42.73,71.64 U$5.D0 41.46,72.75 23.88,72.75 22.73,71.6 U$6.D0 21.46,72.75 11.1,72.75 10,71.65 JP3.28
N$19
  Bottom 0.406: JP3.REFRESH 8.75,80.39 19.05,80.39 20.19,79.25 U$6.REFRESH 21.48,80.39 38.99,80.39 40.19,79.19 U$5.REFRESH 41.48,80.39 58.93,80.39 60.19,79.13 U$2.REFRESH 61.48,80.39 78.74,80.39 80.03,79.1 U$1.REFRESH 81.48,80.39 98.93,80.39 100.19,79.13 U$4.REFRESH
N$20
  Top 0.305: U$4.NMI 131.12,76.56 136.14,71.54 U1.10
  Top 0.406: U$4.NMI 101.46,77.83 83.8,77.83 82.73,76.76 U$1.NMI 81.46,77.83 63.8,77.83 62.73,76.75 U$2.NMI 61.46,77.83 43.81,77.83 42.73,76.74 U$5.NMI 41.46,77.83 23.82,77.83 22.73,76.73 U$6.NMI 21.46,77.83 11.07,77.83 10,76.75 JP3.30
N$21  (via drill 0.5)
  Top 0.254: U1.40 136.64,38.67 v136.88,38.43
  Bottom 0.254: v136.88,38.43 138.35,38.43 148.79,48.87 148.79,79.05 142.39,85.45 101.45,85.45 U$4.HALT
  Bottom 0.406: JP3.HALT 8.64,85.34 19.02,85.34 U$6.HALT 21.48,85.47 38.73,85.47 40.03,84.18 U$5.HALT 41.48,85.47 58.67,85.47 59.97,84.18 U$2.HALT 61.48,85.47 78.61,85.47 79.91,84.18 U$1.HALT 81.48,85.47 98.68,85.47 99.97,84.18 U$4.HALT
N$22
  Top 0.305: U1.17 131.19,60.58 126.62,65.15 104.03,65.15 U$4.D3
  Top 0.406: U$4.D3 101.46,65.13 83.82,65.13 82.73,64.04 U$1.D3 81.46,65.13 63.83,65.13 62.73,64.03 U$2.D3 61.46,65.13 43.81,65.13 42.73,64.04 U$5.D3 41.46,65.13 23.8,65.13 22.73,64.06 U$6.D3 21.46,65.13 11.1,65.13 10,64.03 JP3.25
N$23
  Top 0.305: U$4.RESET 130.23,79.1 136.64,72.69 U1.9
  Top 0.406: U$4.RESET 101.46,80.37 83.8,80.37 82.73,79.3 U$1.RESET 81.46,80.37 63.83,80.37 62.73,79.27 U$2.RESET 61.46,80.37 43.81,80.37 42.73,79.28 U$5.RESET 41.46,80.37 23.82,80.37 22.73,79.27 U$6.RESET 21.46,80.37 11.07,80.37 10,79.29 JP3.31
N$24
  Top 0.305: U$4.BUSREQ 128.94,81.64 137.14,73.44 U1.8
  Top 0.406: U$4.BUSREQ 101.46,82.91 83.84,82.91 82.73,81.79 U$1.BUSREQ 81.46,82.91 63.83,82.91 62.73,81.81 U$2.BUSREQ 61.46,82.91 43.81,82.91 42.73,81.82 U$5.BUSREQ 41.46,82.91 23.82,82.91 22.73,81.81 U$6.BUSREQ 21.46,82.91 11.12,82.91 10,81.78 JP3.32
N$25
  Top 0.305: U$4.MREQ 131.19,89.26 146.23,74.21 146.23,58.88 140.14,52.78 U1.2
  Top 0.406: U$4.MREQ 101.46,90.53 83.82,90.53 82.73,89.44 U$1.MREQ 81.46,90.53 63.83,90.53 62.73,89.42 U$2.MREQ 61.46,90.53 43.81,90.53 42.73,89.44 U$5.MREQ 41.46,90.53 23.8,90.53 22.73,89.46 U$6.MREQ 21.43,90.55 11.12,90.55 10,89.43 JP3.35
N$26  (via drill 0.51)
  Top 0.254: U1.39 136.14,36.99 v136.7,36.42
  Top 0.406: 62.73,91.97 63.8,93.04 81.48,93.04 U$1.WR 82.73,91.95 83.84,93.07 101.46,93.07 U$4.WR | 62.73,91.97 U$2.WR | JP3.36 10,91.94 11.12,93.07 21.46,93.07 U$6.WR 22.73,91.94 23.85,93.07 41.46,93.07 U$5.WR 42.73,92.01 43.76,93.04 61.66,93.04 62.73,91.97
  Bottom 0.305: v136.7,36.42 137.67,36.42 149.61,48.36 149.61,79.25 139.24,89.61 104.91,89.61 U$4.WR
N$27  (via drill 0.5)
  Top 0.254: U1.43 138.14,41.95 v138.46,42.27
  Bottom 0.254: v138.46,42.27 140.46,42.27 145.26,47.07 145.26,64.72 127.03,82.96 101.51,82.96 U$4.WAIT
  Bottom 0.406: U$4.WAIT 99.59,81.64 98.3,82.93 81.48,82.93 U$1.WAIT 80.19,81.73 78.99,82.93 61.48,82.93 U$2.WAIT 59.84,81.64 58.55,82.93 41.48,82.93 U$5.WAIT 40.03,81.64 38.73,82.93 21.48,82.93 U$6.WAIT 18.89,82.93 8.89,82.93 7.6,81.64 JP3.WAIT
N$28  (via drill 0.51)
  Top 0.305: U1.37 135.14,31.87 v135.44,31.57
  Top 0.406: U$4.M1 101.18,98.42 84.45,98.42 82.91,96.88 U$1.M1 81.18,98.42 64.77,98.42 63.22,96.88 U$2.M1 61.18,98.42 44.45,98.42 42.9,96.88 U$5.M1 41.18,98.42 24.77,98.42 23.22,96.88 U$6.M1 21.18,98.42 12.06,98.42 10.52,96.88 JP3.38
  Bottom 0.305: v135.44,31.57 151.59,47.71 151.59,82.27 141.05,92.81 106.79,92.81 U$4.M1
N$30
  Top 0.305: U1.21 129.52,47.72 128.48,48.77 128.48,60.62 125.86,63.25 107.2,63.25 U$4.D5
  Top 0.406: U$4.D5 101.46,60.05 83.77,60.05 82.73,59.01 U$1.D5 81.46,60.05 63.8,60.05 62.73,58.97 U$2.D5 61.46,60.05 43.81,60.05 42.73,58.96 U$5.D5 41.46,60.05 23.8,60.05 22.73,58.98 U$6.D5 21.46,60.05 11.07,60.05 10,58.97 JP3.23
N$31  (via drill 0.51)
  Top 0.305: v137.83,45.59 138.46,46.22 U1.57 | v122.25,41.4 105.68,41.4 U$4.A5
  Top 0.406: U$4.A5 101.46,39.73 83.82,39.73 82.73,38.64 U$1.A5 81.46,39.73 63.8,39.73 62.73,38.65 U$2.A5 61.46,39.73 43.81,39.73 42.73,38.64 U$5.A5 41.46,39.73 23.82,39.73 22.73,38.63 U$6.A5 21.43,39.75 11.12,39.75 10,38.63 JP3.15
  Bottom 0.305: v137.83,45.59 126.44,45.59 v122.25,41.4
N$34  (via drill 0.51)
  Top 0.305: U1.62 141.68,48.72 v140.72,49.68
  Top 0.406: U$4.A9 101.46,21.95 83.77,21.95 82.73,20.91 U$1.A9 81.46,21.95 63.78,21.95 62.73,20.9 U$2.A9 61.46,21.95 43.79,21.95 42.73,20.89 U$5.A9 41.44,21.97 23.85,21.97 22.73,20.85 U$6.A9 21.43,21.97 11.12,21.97 10,20.85 JP3.8
  Bottom 0.305: v140.72,49.68 140.72,49.73 121.7,49.73 107.44,35.48 107.44,22.66 105.46,20.68 U$4.A9
N$38
  Top 0.305: U1.23 128.79,46.72 127.31,48.21 127.31,59.1 124.84,61.57 110.6,61.57 U$4.D7
  Top 0.406: U$4.D7 101.44,54.99 83.82,54.99 82.73,53.9 U$1.D7 81.46,54.97 63.8,54.97 62.73,53.89 U$2.D7 61.46,54.97 43.81,54.97 42.73,53.88 U$5.D7 41.46,54.97 23.82,54.97 22.73,53.87 U$6.D7 21.43,54.99 11.12,54.99 10,53.87 JP3.21
N$39  (via drill 0.51)
  Top 0.305: U1.30 130.04,43.22 129.34,42.52 129.34,41.05 125.55,37.26 v124.44,37.26
  Top 0.406: U$4.A11 101.44,16.89 83.8,16.89 82.73,15.83 U$1.A11 81.44,16.89 63.78,16.89 62.73,15.84 U$2.A11 61.41,16.92 43.79,16.92 42.73,15.86 U$5.A11 41.48,16.84 23.8,16.84 22.73,15.77 U$6.A11 21.48,16.84 11.02,16.84 10,15.82 JP3.6
  Bottom 0.305: v124.44,37.26 102.77,15.6 U$4.A11
N$40
  Top 0.305: U1.33 133.14,25.87 122.86,15.6 105.27,15.6 U$4.A12
  Top 0.406: U$4.A12 101.46,14.33 83.84,14.33 82.73,13.21 U$1.A12 81.44,14.35 63.8,14.35 62.73,13.28 U$2.A12 61.46,14.33 43.81,14.33 42.73,13.24 U$5.A12 41.44,14.35 23.82,14.35 22.73,13.26 U$6.A12 21.46,14.33 11.1,14.33 10,13.23 JP3.5
N$43
  Top 0.305: U1.36 134.64,24.6 123.04,13.01 110.3,13.01 U$4.A15
  Top 0.406: 62.73,5.61 63.83,6.71 81.46,6.71 U$1.A15 82.73,5.62 83.82,6.71 101.46,6.71 U$4.A15 | 62.73,5.61 U$2.A15 | JP3.2 10,5.63 11.1,6.73 21.43,6.73 U$6.A15 22.73,5.61 23.82,6.71 41.46,6.71 U$5.A15 42.73,5.62 43.81,6.71 61.63,6.71 62.73,5.61
N$45
  Top 0.305: U1.27 121.62,44.72 117.7,48.64 102.75,48.64 U$4.A1
  Top 0.406: U$4.A1 101.46,49.89 83.84,49.89 82.73,48.77 U$1.A1 81.46,49.89 63.83,49.89 62.73,48.78 U$2.A1 61.44,49.91 43.84,49.91 42.73,48.8 U$5.A1 41.46,49.89 23.82,49.89 22.73,48.79 U$6.A1 21.46,49.89 11.1,49.89 10,48.79 JP3.19
N$47  (via drill 0.5, 0.51)
  Top 0.254: U1.55 141.62,45.22 v140.92,44.53
  Top 0.305: v128.04,43.36 102.91,43.36 U$4.A3
  Top 0.406: U$4.A3 101.46,44.81 83.8,44.81 82.73,43.74 U$1.A3 81.44,44.83 63.8,44.83 62.73,43.76 U$2.A3 61.46,44.81 43.81,44.81 42.73,43.72 U$5.A3 41.46,44.81 23.8,44.81 22.73,43.74 U$6.A3 21.43,44.83 11.1,44.83 10,43.73 JP3.17
  Bottom 0.254: v140.92,44.53 140.92,43.79 140.41,43.28 135.84,43.28 135,42.44 128.96,42.44 v128.04,43.36
N$48  (via drill 0.51)
  Top 0.254: U1.56 140.62,45.72 v139.48,44.58
  Top 0.305: v125.2,42.34 104.08,42.34 U$4.A4
  Top 0.406: U$4.A4 101.46,42.27 83.82,42.27 82.73,41.18 U$1.A4 81.44,42.29 63.86,42.29 62.73,41.16 U$2.A4 61.46,42.27 43.84,42.27 42.73,41.16 U$5.A4 41.44,42.29 23.82,42.29 22.73,41.2 U$6.A4 21.46,42.27 11.12,42.27 10,41.14 JP3.16
  Bottom 0.254: v139.48,44.58 127.43,44.58 v125.2,42.34
N$52
  Top 0.305: U1.41 137.14,41.25 136.58,41.81 133.25,41.81 132.24,40.79 132.24,35.79 127.82,31.37 120.48,31.37 117.4,28.3 U$4.CLK
  Top 0.406: U$4.CLK U$4.CLK@2 U$1.CLK
  Bottom 0.406: U$1.CLK U$1.CLK@2 U$2.CLK U$2.CLK@2 U$5.CLK U$5.CLK@2 U$6.CLK U$6.CLK@2 JP3.11
N$54
  Top 0.305: JP1.2 121.27,52.75 127.79,46.22 U1.24
N$55
  Top 0.305: U1.25 126.51,45.72 118.69,53.54 118.69,59.25 JP1.3
N$56
  Top 0.305: U$4.BUSACK 130.4,84.18 144.63,69.95 144.63,59.21 139.14,53.72 U1.4
  Top 0.406: U$4.BUSACK 101.46,85.45 83.82,85.45 82.73,84.36 U$1.BUSACK 81.46,85.45 63.83,85.45 62.73,84.34 U$2.BUSACK 61.46,85.45 43.84,85.45 42.73,84.33 U$5.BUSACK 41.46,85.45 23.82,85.45 22.73,84.35 U$6.BUSACK 21.43,85.47 11.1,85.47 10,84.37 JP3.33
N$57
  Top 0.305: 145.42,71.88 145.41,71.88 | U$4.IORQ 130.58,86.72 145.25,72.05 145.41,71.88 | U1.3 139.64,53.25 145.41,59.03 145.41,71.88
  Top 0.406: U$4.IORQ 101.46,87.99 83.82,87.99 82.73,86.9 U$1.IORQ 81.46,87.99 63.86,87.99 62.73,86.86 U$2.IORQ 61.46,87.99 43.84,87.99 42.73,86.88 U$5.IORQ 41.46,87.99 23.85,87.99 22.73,86.86 U$6.IORQ 21.46,87.99 11.1,87.99 10,86.89 JP3.34
N$58  (via drill 0.51, 0.6)
  Top 0.305: U1.7 137.64,66.38 v141.89,70.64 | SW6.2 SW6.1 154.76,83.53 C25.1 152.13,80.95 v147.32,76.15
  Bottom 0.305: v141.89,70.64 141.89,70.71 v147.32,76.15
N$59
  Top 0.305: U1.54 145.31,44.72 148.93,48.34 148.93,67.54 152.25,70.87 SW5.1 SW5.2
N$62  (via drill 0.6)
  Top 0.305: U1.49 145.05,42.22 151.23,36.04 151.23,33.59 v151.22,33.59
  Bottom 0.305: v151.22,33.59 151.22,7.94 148.41,5.12 JP4.6
N$63
  Top 0.305: U1.51 152.46,43.22 154.79,40.89 SW2.2 SW2.1
N$64
  Top 0.305: U1.52 153.05,43.72 SW3.1 SW3.2
N$65
  Top 0.305: U1.53 145.78,44.22 149.69,48.13 149.69,55.6 152.25,58.17 SW4.1 SW4.2
N$66  (via drill 0.51)
  Top 0.305: U1.46 139.64,37.94 141.89,35.69 v141.89,26.21 v141.88,26.21
  Bottom 0.305: JP4.4 145.87,9.28 142.03,13.12 141.89,13.26 141.88,13.26 v141.88,26.21
N$67  (via drill 0.51)
  Top 0.254: U1.42 137.64,28.11 v136.96,27.43
  Top 0.406: R1.1 143.33,4.35 JP4.2
  Bottom 0.254: v136.96,27.43 136.96,21.88 141.33,17.5
  Bottom 0.305: 141.33,17.5 141.33,12.19 143.33,10.19 JP4.2
N$68  (via drill 0.51)
  Top 0.305: U1.38 135.64,34.57 v136.22,33.98
  Top 0.406: 62.73,94.45 63.88,95.61 81.46,95.61 U$1.RD 82.73,94.52 83.82,95.61 101.46,95.61 U$4.RD | 62.73,94.45 U$2.RD | JP3.37 10,94.51 11.1,95.61 21.46,95.61 U$6.RD 22.73,94.46 23.85,95.58 41.48,95.58 U$5.RD 42.73,94.5 43.81,95.58 61.6,95.58 62.73,94.45
  Bottom 0.305: v136.22,33.98 136.42,33.98 150.5,48.06 150.5,80.57 140.31,90.75 106.31,90.75 U$4.RD
N$93  (via drill 0.6)
  Top 0.305: U1.45 v139.14,14.9 | v133.2,8.97 J1.D+
  Bottom 0.305: v139.14,14.9 v133.2,8.97
N$94
  Top 0.305: U1.6 138.14,62.13 arc-90 Y1.1 141.24,65.24 C8.1
N$95
  Top 0.305: U1.5 138.64,57.55 arc-90 Y1.2 141.85,58.42 C7.1
N$96  (via drill 0.6)
  Top 0.305: U1.44 138.64,16.23 v137.83,15.42 | v132.03,8 132.55,7.48 J1.D-
  Bottom 0.305: v137.83,15.42 132.03,9.63 v132.03,8
N$128  (via drill 0.51)
  Top 0.305: v119.2,40.21 107.02,40.21 U$4.A6 | U1.58 134.94,46.72 v134.93,46.74
  Top 0.406: U$4.A6 101.44,37.21 83.82,37.21 82.73,36.12 U$1.A6 81.46,37.19 63.8,37.19 62.73,36.11 U$2.A6 61.46,37.19 43.81,37.19 42.73,36.1 U$5.A6 41.44,37.21 23.82,37.21 22.73,36.12 U$6.A6 21.46,37.19 11.1,37.19 10,36.09 JP3.14
  Bottom 0.305: v134.93,46.74 125.73,46.74 v119.2,40.21
N$132
  Top 0.305: U1.28 104.58,44.22 U$4.A2
  Top 0.406: U$4.A2 101.46,47.35 83.87,47.35 82.73,46.2 U$1.A2 81.46,47.35 63.8,47.35 62.73,46.27 U$2.A2 61.46,47.35 43.84,47.35 42.73,46.23 U$5.A2 41.46,47.35 23.8,47.35 22.73,46.28 U$6.A2 21.43,47.37 11.1,47.37 10,46.27 JP3.18
SW1
  Top 0.305: U1.50 148.67,42.72 152.84,38.56 152.84,27.61 SW1.2 SW1.1

### Text on the board
tNames: 1 | 2 | 1 | 2 | M1 | M1 | RD | 3 | 4 | 3 | 4 | RD | WR | WR | MREQ | MREQ | MCU / RESET | IORQ | IORQ | HALT | HALT | BUSACK | BUSACK | WAIT | BUSREQ | WAIT | BUSREQ | REFRESH | RESET | RESET | REFRESH | RUN/STOP | NMI | NMI | INT | INTI | INTO | INTI | INTO | INTI | INTO | INTI | INTO | INTI | INTO | D0 | D0 | INS STEP | 5V | RX | TX | D7 | GND | D7 | A0 | CLK STEP | A0 | TRACE | A7 | A7 | 3V3 | CLK | 3V3 | CLK | Z80 / RESET | A8 | A8 | GND | A10 | GND | A11 | FAP80 Backplane V2 / dekuNukem 2016 | PA9 | DIO | CLK | A15 | 5V | 3V3 | GND | 5V | 75 | 76 | A15 | 75 | 76 | 5V